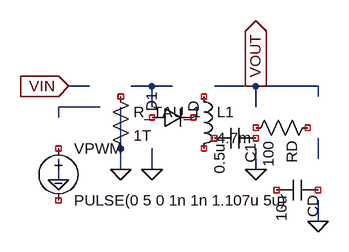
[diagram p0: schematic Buck25to5.asc]
Buck25to5.asc, the LTspice schematic file:
Version 4
SHEET 1 880 680
WIRE 192 128 224 128
WIRE 288 128 320 128
WIRE 320 128 352 128
WIRE 320 160 320 128
WIRE 320 224 320 256
WIRE 176 176 176 160
WIRE 176 160 240 160
WIRE 176 240 176 272
WIRE 272 160 272 256
WIRE 416 128 480 128
WIRE 480 128 576 128
WIRE 480 128 480 160
WIRE 480 224 480 256
WIRE 576 128 576 144
WIRE 576 208 576 240
WIRE 576 304 576 336
FLAG 320 256 0
FLAG 176 272 0
FLAG 272 256 0
FLAG 480 256 0
FLAG 576 336 0
FLAG 192 128 VIN
IOPIN 192 128 In
FLAG 480 128 VOUT
IOPIN 480 128 Out
SYMBOL res 256 128 R0
SYMATTR InstName R_TAU_1
SYMATTR TauLabel S1
SYMATTR Value 1T
SYMATTR TauKind switch
SYMATTR TauValue TAU_SW
SYMBOL ind 384 128 R0
SYMATTR InstName L1
SYMATTR Value 4.7m
SYMATTR TauKind inductor
SYMATTR TauValue 4.7m
SYMATTR TauLabel L1
SYMBOL diode 320 192 R270
SYMATTR InstName D1
SYMATTR Value D
SYMATTR TauKind diode
SYMATTR TauValue D Is=1e-14 N=1
SYMATTR TauLabel D1
SYMBOL voltage 176 208 R0
SYMATTR InstName VPWM
SYMATTR Value PULSE(0 5 0 1n 1n 1.107u 5u)
SYMATTR TauKind vsource
SYMATTR TauValue PULSE(0 5 0 1n 1n 1.107u 5u)
SYMATTR TauLabel VPWM
SYMBOL cap 480 192 R90
SYMATTR InstName C1
SYMATTR Value 0.5u
SYMATTR TauKind capacitor
SYMATTR TauValue 0.5u
SYMATTR TauLabel C1
SYMBOL res 576 176 R90
SYMATTR InstName RD
SYMATTR Value 100
SYMATTR TauKind resistor
SYMATTR TauValue 100
SYMATTR TauLabel RD
SYMBOL cap 576 272 R90
SYMATTR InstName CD
SYMATTR Value 10u
SYMATTR TauKind capacitor
SYMATTR TauValue 10u
SYMATTR TauLabel CD

The netlist it stands for:
* Buck25to5.asc
R_TAU_1 NC_01 0 1T
L1 NC_02 NC_03 4.7m
D1 NC_04 NC_05 D
VPWM NC_06 NC_07 PULSE(0 5 0 1n 1n 1.107u 5u)
C1 NC_08 NC_09 0.5u
RD NC_10 NC_11 100
CD NC_12 NC_13 10u
.model D D
.lib standard.dio
.backanno
.end